# Altium schematic sheet PCA9555.SchDoc
size A3; SheetNumber: 7; SheetTotal: 9
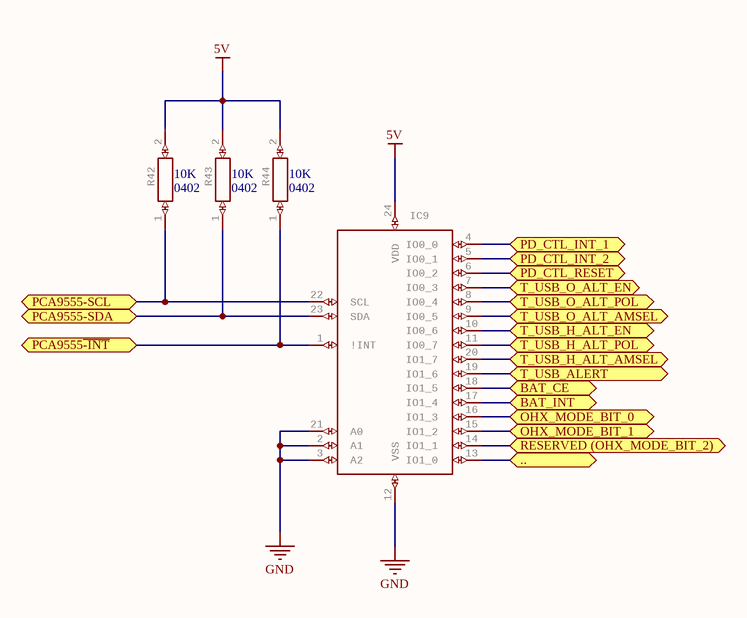
[diagram p0: PCA9555.SchDoc]

## Parts
IC9  Interface - I/O Expanders 16-BIT I2C FM TP GPIO INT PU   Source:  Datasheet  [SOIC127P1032X265-24N]  (value not drawn)
R42  value 10K  Package: 0402  [RESC1005X40N]  (hidden comment: GENERAL PURPOSE CHIP RESISTORS   Source:  Datasheet)
R43  value 10K  Package: 0402  [RESC1005X40N]  (hidden comment: GENERAL PURPOSE CHIP RESISTORS   Source:  Datasheet)
R44  value 10K  Package: 0402  [RESC1005X40N]  (hidden comment: GENERAL PURPOSE CHIP RESISTORS   Source:  Datasheet)

## Ports
.. (bidir), BAT_CE (bidir), BAT_INT (bidir), OHX_MODE_BIT_0 (bidir), OHX_MODE_BIT_1 (bidir), PCA9555-SCL (bidir), PCA9555-SDA (bidir), PCA9555~{-INT} (bidir), PD_CTL_INT_1 (bidir), PD_CTL_INT_2 (bidir), PD_CTL_RESET (bidir), RESERVED (OHX_MODE_BIT_2) (bidir), T_USB_ALERT (bidir), T_USB_H_ALT_AMSEL (bidir), T_USB_H_ALT_EN (bidir), T_USB_H_ALT_POL (bidir), T_USB_O_ALT_AMSEL (bidir), T_USB_O_ALT_EN (bidir), T_USB_O_ALT_POL (bidir)

## Nets
5V: IC9.24(VDD) R42.2 R43.2 R44.2
GND: IC9.2(A1) IC9.3(A2) IC9.12(VSS) IC9.21(A0)
..: IC9.13(IO1_0) ; port ..
BAT_CE: IC9.18(IO1_5) ; port BAT_CE
BAT_INT: IC9.17(IO1_4) ; port BAT_INT
OHX_MODE_BIT_0: IC9.16(IO1_3) ; port OHX_MODE_BIT_0
OHX_MODE_BIT_1: IC9.15(IO1_2) ; port OHX_MODE_BIT_1
PCA9555~{-INT}: IC9.1(!INT) R44.1 ; port PCA9555~{-INT}
PCA9555-SCL: IC9.22(SCL) R42.1 ; port PCA9555-SCL
PCA9555-SDA: IC9.23(SDA) R43.1 ; port PCA9555-SDA
PD_CTL_INT_1: IC9.4(IO0_0) ; port PD_CTL_INT_1
PD_CTL_INT_2: IC9.5(IO0_1) ; port PD_CTL_INT_2
PD_CTL_RESET: IC9.6(IO0_2) ; port PD_CTL_RESET
RESERVED (OHX_MODE_BIT_2): IC9.14(IO1_1) ; port RESERVED (OHX_MODE_BIT_2)
T_USB_ALERT: IC9.19(IO1_6) ; port T_USB_ALERT
T_USB_H_ALT_AMSEL: IC9.20(IO1_7) ; port T_USB_H_ALT_AMSEL
T_USB_H_ALT_EN: IC9.10(IO0_6) ; port T_USB_H_ALT_EN
T_USB_H_ALT_POL: IC9.11(IO0_7) ; port T_USB_H_ALT_POL
T_USB_O_ALT_AMSEL: IC9.9(IO0_5) ; port T_USB_O_ALT_AMSEL
T_USB_O_ALT_EN: IC9.7(IO0_3) ; port T_USB_O_ALT_EN
T_USB_O_ALT_POL: IC9.8(IO0_4) ; port T_USB_O_ALT_POL

## Library data of the parts
IC9 = PCA9555D,118: Manufacturer_Name: NXP; GateName_1: G$1; SymbolName_1: PCA9555D,118; LibraryName: PCA9555D_118; DeviceSetName: PCA9555D,118; Package: SOIC127P1032X265-24N; Manufacturer_Part_Number: PCA9555D,118; Mouser_Part_Number: 771-PCA9555D-T; Mouser_Price-Stock: https://www.mouser.co.uk/ProductDetail/NXP-Semiconductors/PCA9555D118?qs=LOCUfHb8d9tGZvX3C7Uu1g%3D%3D; Arrow_Part_Number: PCA9555D,118; Arrow_Price-Stock: https://www.arrow.com/en/products/pca9555d118/nxp-semiconductors?region=nac; Height: 2.65mm
R42-R44 = RC0402FR-071KL: Manufacturer_Name: KEMET; GateName_1: G$1; SymbolName_1: RC0402FR-071KL; LibraryName: RC0402FR-071KL; DeviceSetName: RC0402FR-071KL; Manufacturer_Part_Number: RC0402FR-071KL; Mouser_Part_Number: 603-RC0402FR-071KL; Mouser_Price-Stock: https://www.mouser.co.uk/ProductDetail/YAGEO/RC0402FR-071KL?qs=V1yeUXFNrknDEmWLmm5v6g%3D%3D; Arrow_Part_Number: RC0402FR-071KL; Arrow_Price-Stock: https://www.arrow.com/en/products/rc0402fr-071kl/yageo?region=nac; Height: 0.4mm